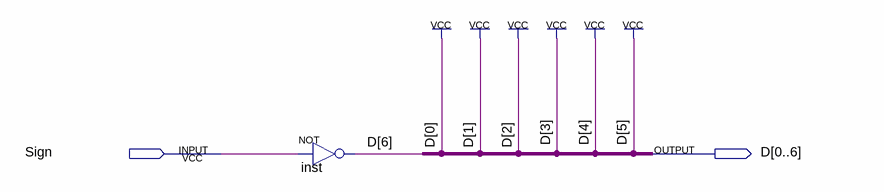
[diagram p0: schematic sheet]
// Quartus schematic Seven_Segment_Display_signOnly.bdf as structural Verilog: 1 symbols, 2 pins
module Seven_Segment_Display_signOnly (
  input  Sign,
  output [0:6] D
);

  not inst (D[6], Sign);

  assign D[0:5] = {6{1'b1}};
endmodule
